# EAGLE design i2c-8ch-mux (EAGLE 7.5.0)
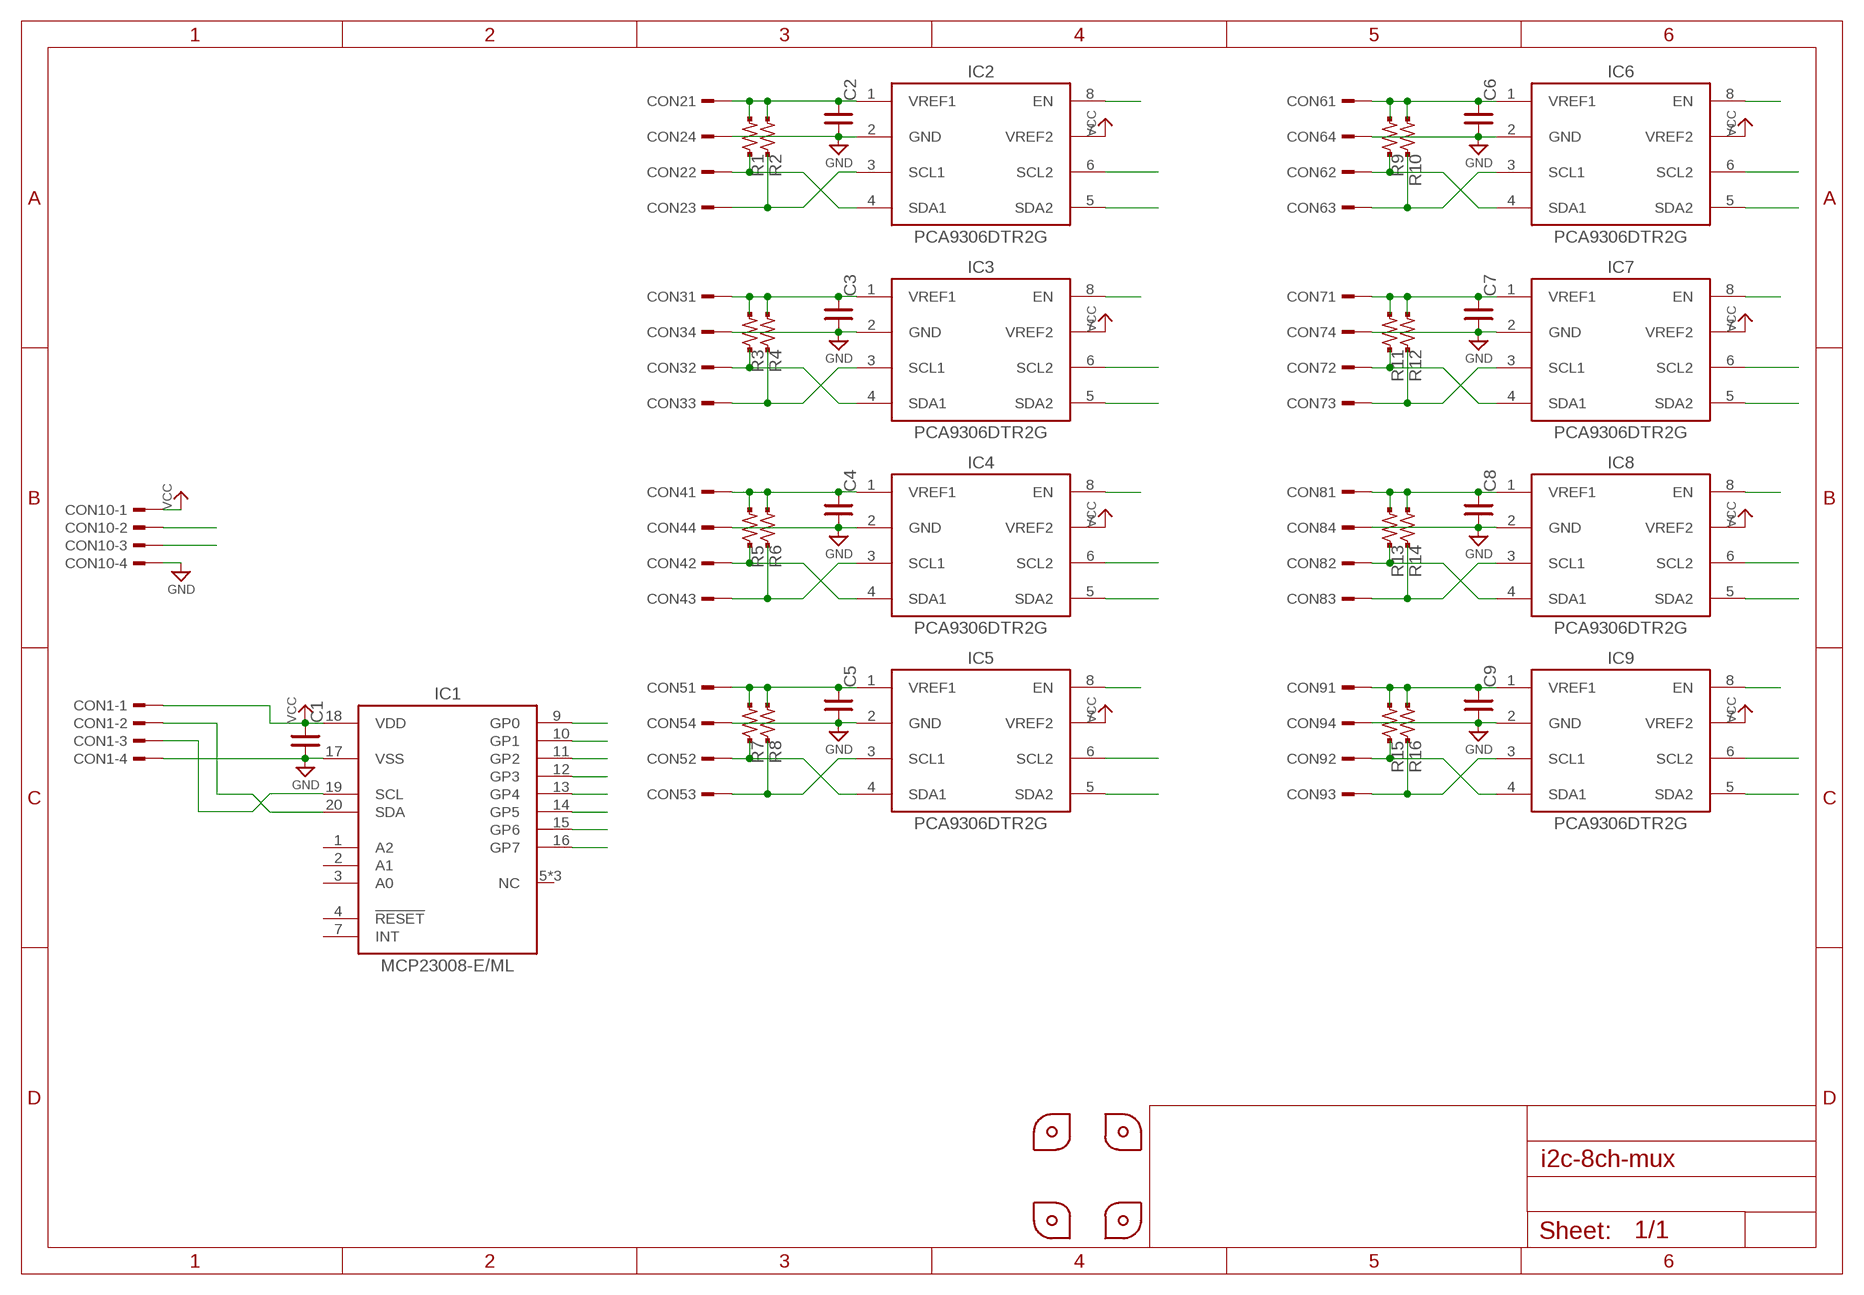
[diagram p0: schematic, sheet 1]

## Parts
C1  C-SMD-0.1U-1005  [C0402]
C2  C-SMD-0.1U-1005  [C0402]
C3  C-SMD-0.1U-1005  [C0402]
C4  C-SMD-0.1U-1005  [C0402]
C5  C-SMD-0.1U-1005  [C0402]
C6  C-SMD-0.1U-1005  [C0402]
C7  C-SMD-0.1U-1005  [C0402]
C8  C-SMD-0.1U-1005  [C0402]
C9  C-SMD-0.1U-1005  [C0402]
CON1  S4B-XH-A  [S4B-XH-A(LF)(SN)]
CON2  B4B-XH-A  [B4B-XH-A(LF)(SN)]
CON3  B4B-XH-A  [B4B-XH-A(LF)(SN)]
CON4  B4B-XH-A  [B4B-XH-A(LF)(SN)]
CON5  B4B-XH-A  [B4B-XH-A(LF)(SN)]
CON6  B4B-XH-A  [B4B-XH-A(LF)(SN)]
CON7  B4B-XH-A  [B4B-XH-A(LF)(SN)]
CON8  B4B-XH-A  [B4B-XH-A(LF)(SN)]
CON9  B4B-XH-A  [B4B-XH-A(LF)(SN)]
CON10  S4B-XH-A  [S4B-XH-A(LF)(SN)]
IC1  MCP23008-E/ML  [QFN20-0.5P4.0X4.0]
IC2  PCA9306DTR2G  [SOT65P440X300-8N]
IC3  PCA9306DTR2G  [SOT65P440X300-8N]
IC4  PCA9306DTR2G  [SOT65P440X300-8N]
IC5  PCA9306DTR2G  [SOT65P440X300-8N]
IC6  PCA9306DTR2G  [SOT65P440X300-8N]
IC7  PCA9306DTR2G  [SOT65P440X300-8N]
IC8  PCA9306DTR2G  [SOT65P440X300-8N]
IC9  PCA9306DTR2G  [SOT65P440X300-8N]
P1  PCB-CORNER  [PCB-CORNER]
P2  PCB-CORNER  [PCB-CORNER]
P3  PCB-CORNER  [PCB-CORNER]
P4  PCB-CORNER  [PCB-CORNER]
R1  R-US-10K-1005  [C0402]
R2  R-US-10K-1005  [C0402]
R3  R-US-10K-1005  [C0402]
R4  R-US-10K-1005  [C0402]
R5  R-US-10K-1005  [C0402]
R6  R-US-10K-1005  [C0402]
R7  R-US-10K-1005  [C0402]
R8  R-US-10K-1005  [C0402]
R9  R-US-10K-1005  [C0402]
R10  R-US-10K-1005  [C0402]
R11  R-US-10K-1005  [C0402]
R12  R-US-10K-1005  [C0402]
R13  R-US-10K-1005  [C0402]
R14  R-US-10K-1005  [C0402]
R15  R-US-10K-1005  [C0402]
R16  R-US-10K-1005  [C0402]

## Nets
GND: C1.2 C2.2 C3.2 C4.2 C5.2 C6.2 C7.2 C8.2 C9.2 CON1.4 CON2.4 CON3.4 CON4.4 CON5.4 CON6.4 CON7.4 CON8.4 CON9.4 CON10.4 IC1.17(VSS) IC2.2(GND) IC3.2(GND) IC4.2(GND) IC5.2(GND) IC6.2(GND) IC7.2(GND) IC8.2(GND) IC9.2(GND)
N$1: C3.1 CON3.1 IC3.1(VREF1) R3.2 R4.2
N$2: CON3.2 IC3.4(SDA1) R3.1
N$3: C5.1 CON5.1 IC5.1(VREF1) R7.2 R8.2
N$4: C2.1 CON2.1 IC2.1(VREF1) R1.2 R2.2
N$5: CON3.3 IC3.3(SCL1) R4.1
N$6: IC1.10(GP1) IC3.8(EN)
N$7: IC1.9(GP0) IC2.8(EN)
N$8: IC1.11(GP2) IC4.8(EN)
N$9: CON1.3 CON10.3 IC1.19(SCL) IC2.6(SCL2) IC3.6(SCL2) IC4.6(SCL2) IC5.6(SCL2) IC6.6(SCL2) IC7.6(SCL2) IC8.6(SCL2) IC9.6(SCL2)
N$10: CON1.2 CON10.2 IC1.20(SDA) IC2.5(SDA2) IC3.5(SDA2) IC4.5(SDA2) IC5.5(SDA2) IC6.5(SDA2) IC7.5(SDA2) IC8.5(SDA2) IC9.5(SDA2)
N$11: CON2.2 IC2.4(SDA1) R1.1
N$12: CON2.3 IC2.3(SCL1) R2.1
N$13: C8.1 CON8.1 IC8.1(VREF1) R13.2 R14.2
N$14: C9.1 CON9.1 IC9.1(VREF1) R15.2 R16.2
N$15: C4.1 CON4.1 IC4.1(VREF1) R5.2 R6.2
N$16: CON4.3 IC4.3(SCL1) R6.1
N$17: CON4.2 IC4.4(SDA1) R5.1
N$18: CON5.2 IC5.4(SDA1) R7.1
N$19: CON5.3 IC5.3(SCL1) R8.1
N$20: C6.1 CON6.1 IC6.1(VREF1) R9.2 R10.2
N$21: CON7.2 IC7.4(SDA1) R11.1
N$22: CON7.3 IC7.3(SCL1) R12.1
N$23: IC1.12(GP3) IC5.8(EN)
N$24: IC1.13(GP4) IC6.8(EN)
N$25: IC1.14(GP5) IC7.8(EN)
N$26: IC1.15(GP6) IC8.8(EN)
N$27: IC1.16(GP7) IC9.8(EN)
N$28: C7.1 CON7.1 IC7.1(VREF1) R11.2 R12.2
N$29: CON6.2 IC6.4(SDA1) R9.1
N$30: CON6.3 IC6.3(SCL1) R10.1
N$31: CON8.2 IC8.4(SDA1) R13.1
N$32: CON8.3 IC8.3(SCL1) R14.1
N$33: CON9.2 IC9.4(SDA1) R15.1
N$34: CON9.3 IC9.3(SCL1) R16.1
VCC: C1.1 CON1.1 CON10.1 IC1.18(VDD) IC2.7(VREF2) IC3.7(VREF2) IC4.7(VREF2) IC5.7(VREF2) IC6.7(VREF2) IC7.7(VREF2) IC8.7(VREF2) IC9.7(VREF2)
Unconnected: IC1.1(A2) IC1.2(A1) IC1.3(A0) IC1.4(!RESET!) IC1.5(NC) IC1.6(NC) IC1.7(INT) IC1.8(NC)

## Library data of the parts
C1-C9 = mylib:C-SMD-*: SMD CAPACITOR; DIGIKEY: 490-3261-1-ND; SEEED: 302010024; SMD-PAD: 2
CON1 CON10 = mylib:S4B-XH-A
CON2-CON9 = mylib:B4B-XH-A
IC1 = mylib:MCP23008
IC2-IC9 = mylib:PCA9306
P1-P4 = mylib:PCB-CORNER; NOT-COMPONENT: YES
R1-R16 = mylib:R-US-*: SMD resistor Packages : -1608 : 1.6 x 0.8 mm -2125 : 2.0 x 1.25 mm -3216 : 3.2 x 1.6 mm; DIGIKEY: P10.0KLCT-ND; SEEED: 301010047; SMD-PAD: 2

## Board
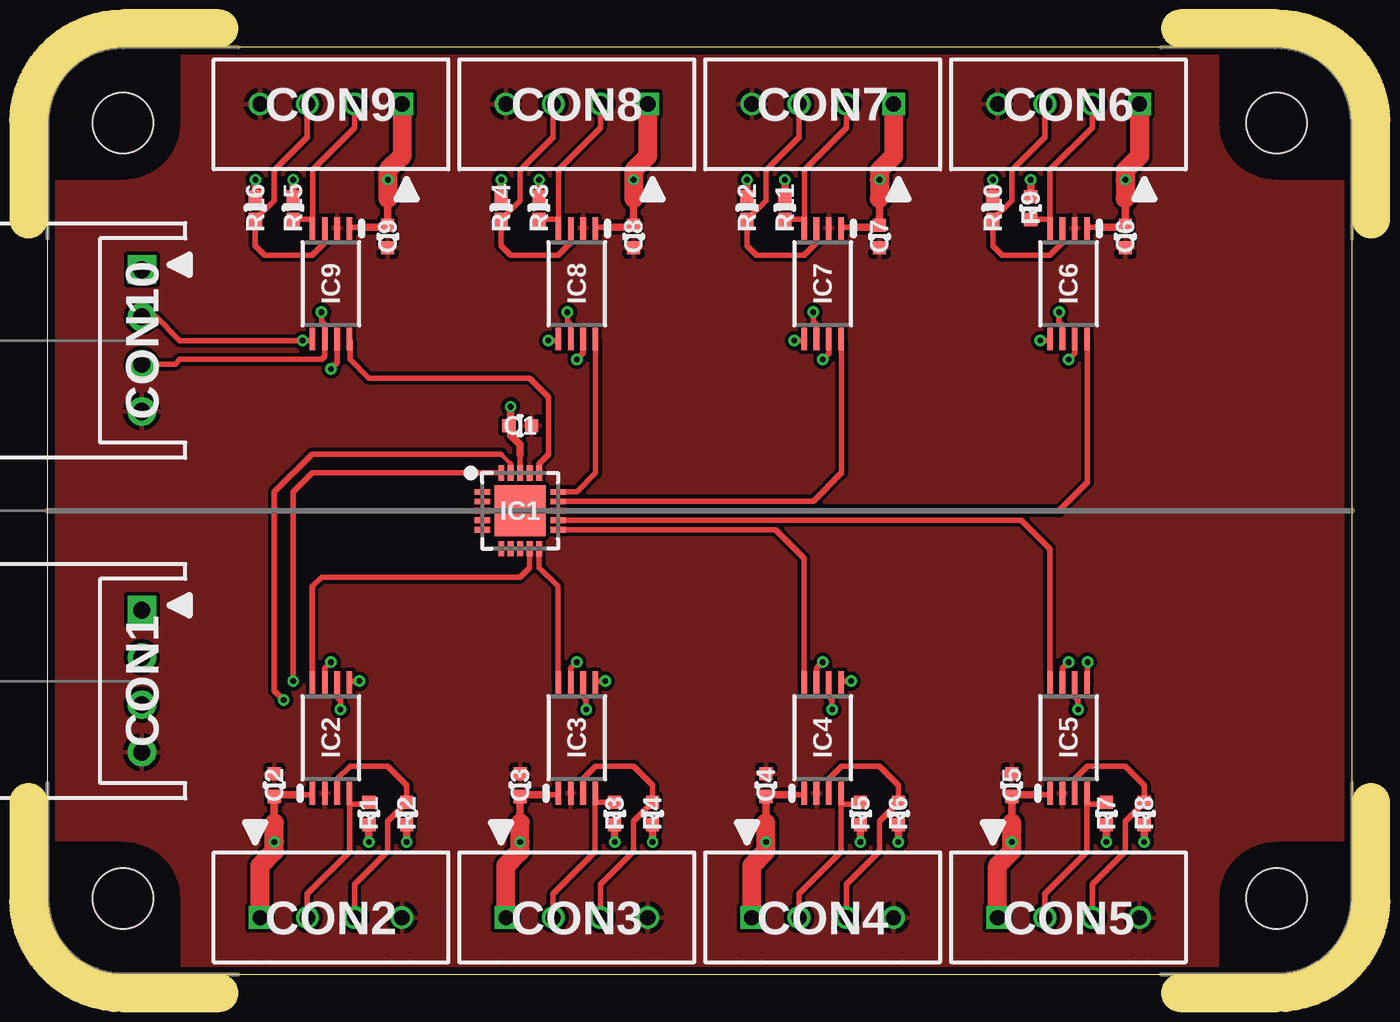
[diagram p1: board, top side]
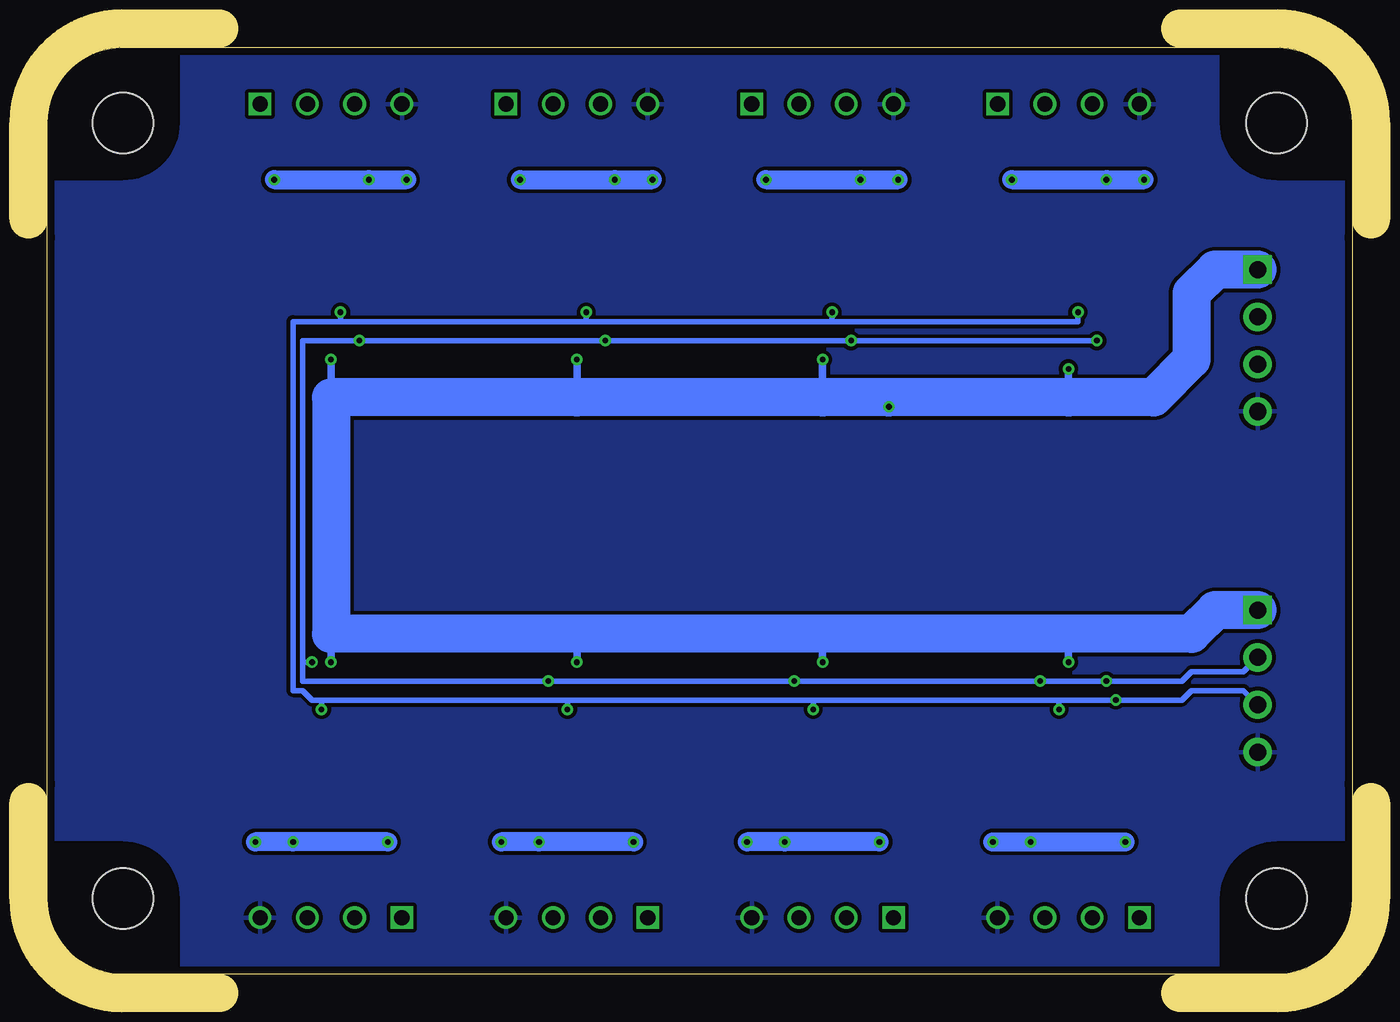
[diagram p2: board, bottom side, seen from below]

Size 69 x 49 mm. Coordinates in mm from the lower left corner, seen from the top.
Outline: 0,39 0,10
Outline: 10,0 59,0
Outline: 69,10 69,39
Outline: 59,49 10,49
Copper layers (1*16): Top 0.035mm / dielectric 1.5mm / Bottom 0.035mm
Design rules "default *": minimum track width 0.2mm, minimum drill 0.3mm, track to track 0.2mm, track to pad 0.2mm, pad to pad 0.2mm, via to via 0.2mm, smd to smd 0mil, copper to edge 0.4mm, drill to drill 8mil, minimum pad ring 0.15mm, minimum via ring 0.15mm, stop-mask expansion 4mil, vias tented up to drill 100mil, thermal gap 10mil

### Footprints (pad centres in the part's own frame; a part is rotated, then mirrored left to right if it is on the bottom)
C0402 = smd 0.7 x 0.7: 1 -0.6,0; 2 0.6,0
S4B-XH-A(LF)(SN) = drill 0.9 pad 1.5 square: 1 -3.75,0 | drill 0.9 pad 1.5: 2 -1.25,0; 3 1.25,0; 4 3.75,0
B4B-XH-A(LF)(SN) = drill 0.8 square: 1 3.75,0 | drill 0.8: 2 1.25,0; 3 -1.25,0; 4 -3.75,0
QFN20-0.5P4.0X4.0 = smd 0.8 x 0.3: 1 -2,1; 2 -2,0.5; 3 -2,0; 4 -2,-0.5; 5 -2,-1; 11 2,-1; 12 2,-0.5; 13 2,0; 14 2,0.5; 15 2,1 | smd 0.3 x 0.8: 6 -1,-2; 7 -0.5,-2; 8 0,-2; 9 0.5,-2; 10 1,-2; 16 1,2; 17 0.5,2; 18 0,2; 19 -0.5,2; 20 -1,2 | smd 2.7 x 2.7: EP 0,0
SOT65P440X300-8N = smd 0.3 x 1.2: 1 -0.975,-2.925; 2 -0.325,-2.925; 3 0.325,-2.925; 4 0.975,-2.925; 5 0.975,2.925; 6 0.325,2.925; 7 -0.325,2.925; 8 -0.975,2.925
PCB-CORNER = hole 3.2: 0,0

### Placement (x,y rotation side)
C1  25,29 0 top
C2  12,10 90 top
C3  25,10 90 top
C4  38,10 90 top
C5  51,10 90 top
C6  57,39 270 top
C7  44,39 270 top
C8  31,39 270 top
C9  18,39 270 top
CON1  5,15.5 270 top
CON2  15,3 180 top
CON3  28,3 180 top
CON4  41,3 180 top
CON5  54,3 180 top
CON6  54,46 0 top
CON7  41,46 0 top
CON8  28,46 0 top
CON9  15,46 0 top
CON10  5,33.5 270 top
IC1  25,24.5 0 top
IC2  15,12.5 0 top
IC3  28,12.5 0 top
IC4  41,12.5 0 top
IC5  54,12.5 0 top
IC6  54,36.5 180 top
IC7  41,36.5 180 top
IC8  28,36.5 180 top
IC9  15,36.5 180 top
P1  4,4 270 top
P2  65,4 0 top
P3  4,45 180 top
P4  65,45 90 top
R1  17,8.5 270 top
R2  19,8.5 270 top
R3  30,8.5 270 top
R4  32,8.5 270 top
R5  43,8.5 270 top
R6  45,8.5 270 top
R7  56,8.5 270 top
R8  58,8.5 270 top
R9  52,40.5 90 top
R10  50,40.5 90 top
R11  39,40.5 90 top
R12  37,40.5 90 top
R13  26,40.5 90 top
R14  24,40.5 90 top
R15  13,40.5 90 top
R16  11,40.5 90 top

### Tracks (layer width: path | path; a pad name or v marks a point on that pad's centre or on a via)
GND
  pour Bottom (rank 2): 0,49 69,49 69,0 0,0
  pour Top: 0,49 69,49 69,0 0,0
N$1  (via drill 0.3)
  Top 0.3: IC3.1 27.02,9.53 27,9.5 26.5,9.5
  Top 0.4: 26.5,9.5 25,9.5 C3.1 25,8 | R4.2 v32,7 | R3.2 v30,7
  Top 1: CON3.1 24.25,5.75 25,6.5 v25,7 25,8
  Bottom 1: v25,7 v30,7 v32,7
N$2
  Top 0.3: R3.1 28.98,9.1 | 28.98,9.1 IC3.4 | CON3.2 26.75,4.25 28.98,6.47 28.98,9.1
N$3  (via drill 0.3)
  Top 0.3: IC5.1 53.02,9.53 53,9.5 52.5,9.5
  Top 0.4: 52.5,9.5 51,9.5 C5.1 51,8 | R8.2 v58,7 | R7.2 v56,7
  Top 1: CON5.1 50.25,5.75 51,6.5 v51,7 51,8
  Bottom 1: v51,7 v56,7 v58,7
N$4  (via drill 0.3)
  Top 0.3: IC2.1 14.03,9.53 14,9.5 13.5,9.5
  Top 0.4: 13.5,9.5 12,9.5 C2.1 12,8 | R2.2 v19,7 | R1.2 v17,7
  Top 1: CON2.1 11.25,5.75 12,6.5 v12,7 12,8
  Bottom 1: v19,7 v17,7 v12,7
N$5
  Top 0.3: IC3.3 28.32,10.32 29,11 31,11 32,10 R4.1 31,8.1 31,6.5 29.25,4.75 CON3.3
N$6
  Top 0.3: IC1.10 26,21.5 27,20.5 27,15.5 27.02,15.47 IC3.8
N$7
  Top 0.3: IC1.9 25.5,21.5 25,21 14.5,21 14,20.5 14,15.5 14.03,15.47 IC2.8
N$8
  Top 0.3: IC4.8 40.02,15.47 40,15.5 40,22 38.5,23.5 IC1.11
N$9  (via drill 0.3)
  Top 0.2: 24.5,27 24,27.5
  Top 0.3: IC2.6 15.32,14.68 15.5,14.5 v15.5,14 | IC3.6 28.32,14.68 28.5,14.5 v28.5,14 | IC4.6 41.33,14.68 41.5,14.5 v41.5,14 | IC5.6 54.33,14.68 54.5,14.5 v54.5,14 | v14.5,35 14.5,34.5 14.68,34.33 IC9.6 14.68,32.67 14.5,32.5 7,32.5 6.75,32.25 CON10.3 | IC8.6 27.68,34.33 27.5,34.5 v27.5,35 | IC7.6 40.67,34.33 40.5,34.5 v40.5,35 | IC6.6 53.67,34.33 53.5,34.5 v53.5,35 | v12.5,14.5 12,15 12,25.5 14,27.5 24,27.5 | IC1.19 24.5,27
  Bottom 0.3: 54.5,14.5 55,14.5 55.5,15 56,15 56,34.5 53.5,34.5 | 54.5,14.5 41.5,14.5 | 41.5,14.5 28.5,14.5 | 28.5,14.5 15.5,14.5 | 15.5,14.5 v12.5,14.5 9,14.5 8.5,15 5.75,15 CON1.3 | v41.5,14 41.5,14.5 | v54.5,14 54.5,14.5 | 53.5,34.5 40.5,34.5 | 40.5,34.5 27.5,34.5 | 27.5,34.5 14.5,34.5 v14.5,35 | v53.5,35 53.5,34.5 | v40.5,35 40.5,34.5 | v27.5,35 27.5,34.5 | v28.5,14 28.5,14.5 | v15.5,14 15.5,14.5
N$10  (via drill 0.3)
  Top 0.3: IC9.5 14.03,33.52 14,33.5 v13.5,33.5 7,33.5 5.75,34.75 CON10.2 | IC8.5 26.95,33.5 v26.5,33.5 | IC7.5 39.95,33.5 v39.5,33.5 | IC6.5 52.95,33.5 v52.5,33.5 | IC4.5 42.05,15.5 v42.5,15.5 | IC3.5 29.05,15.5 v29.5,15.5 | IC2.5 16.05,15.5 v16.5,15.5 | v13,15.5 13,25.5 14,26.5 IC1.20 | IC5.5 54.98,15.47 55,15.5 v55,16.5
  Bottom 0.3: 55.5,16.5 55.5,15.5 v42.5,15.5 v29.5,15.5 v16.5,15.5 v13,15.5 9,15.5 8.5,16 5.75,16 CON1.2 | 55.5,16.5 55.5,33.5 v52.5,33.5 v39.5,33.5 v26.5,33.5 v13.5,33.5 | v55,16.5 55.5,16.5
N$11
  Top 0.3: R1.1 17,9 15.97,9 | 15.97,9 IC2.4 | 15.97,9 15.97,6.47 13.75,4.25 CON2.2
N$12
  Top 0.3: IC2.3 15.32,10.32 16,11 18,11 19,10 R2.1 18,8.1 18,6.5 16.25,4.75 CON2.3
N$13  (via drill 0.3)
  Top 0.3: IC8.1 28.98,39.48 29,39.5 29.5,39.5
  Top 0.4: 31,41 C8.1 31,39.5 29.5,39.5 | R13.2 v26,42 | v24,42 R14.2
  Top 1: CON8.1 31.75,43.25 31,42.5 v31,42 31,41
  Bottom 1: v31,42 v26,42 v24,42
N$14  (via drill 0.3)
  Top 0.3: IC9.1 15.97,39.48 16,39.5 16.5,39.5 | C9.1 18,39.5
  Top 0.4: 18,39.5 16.5,39.5 | C9.1 18,41 | R15.2 v13,42 | R16.2 v11,42
  Top 1: CON9.1 18.75,43.25 18,42.5 v18,42 18,41
  Bottom 1: v18,42 v13,42 v11,42
N$15  (via drill 0.3)
  Top 0.3: IC4.1 40.02,9.53 40,9.5 39.5,9.5
  Top 0.4: 39.5,9.5 38,9.5 C4.1 38,8 | R6.2 v45,7 | R5.2 v43,7
  Top 1: CON4.1 37.25,5.75 38,6.5 v38,7 38,8
  Bottom 1: v38,7 v43,7 v45,7
N$16
  Top 0.3: CON4.3 42.25,4.75 44,6.5 44,8.1 R6.1 45,10 44,11 42,11 41.33,10.32 IC4.3
N$17
  Top 0.3: R5.1 43,9 41.98,9 | 41.98,9 IC4.4 | CON4.2 39.75,4.25 41.98,6.47 41.98,9
N$18
  Top 0.3: R7.1 56,9 54.98,9 | 54.98,9 IC5.4 | 54.98,9 54.98,6.47 52.75,4.25 CON5.2
N$19
  Top 0.3: IC5.3 54.33,10.32 55,11 57,11 58,10 R8.1 57,8.1 57,6.5 55.25,4.75 CON5.3
N$20  (via drill 0.3)
  Top 0.3: IC6.1 54.98,39.48 55,39.5 55.5,39.5
  Top 0.4: 57,41 C6.1 57,39.5 55.5,39.5 | R9.2 v52,42 | v50,42 R10.2
  Top 1: CON6.1 57.75,43.25 57,42.5 v57,42 57,41
  Bottom 1: v57,42 v52,42 v50,42
N$21
  Top 0.3: IC7.4 40.02,39.9 | 40.02,39.9 R11.1 | CON7.2 42.25,44.75 40.02,42.52 40.02,39.9
N$22
  Top 0.3: CON7.3 39.75,44.25 38,42.5 38,40.9 R12.1 37,38.5 37.5,38 40,38 40.67,38.67 IC7.3
N$23
  Top 0.3: IC5.8 53.02,15.47 53,15.5 53,22.5 51.5,24 IC1.12
N$24
  Top 0.3: IC6.8 54.98,33.52 55,33.5 55,26 53.5,24.5 IC1.13
N$25
  Top 0.3: IC7.8 41.98,33.52 42,33.5 42,26.5 40.5,25 IC1.14
N$26
  Top 0.3: IC8.8 28.98,33.52 29,33.5 29,26.5 28,25.5 IC1.15
N$27
  Top 0.3: IC1.16 26,27 26.5,27.5 26.5,30.5 25.5,31.5 17,31.5 16,32.5 16,33.5 15.97,33.52 IC9.8
N$28  (via drill 0.3)
  Top 0.3: IC7.1 41.98,39.48 42,39.5 42.5,39.5
  Top 0.4: 44,41 C7.1 44,39.5 42.5,39.5 | R11.2 v39,42 | v37,42 R12.2
  Top 1: CON7.1 44.75,43.25 44,42.5 v44,42 44,41
  Bottom 1: v44,42 v39,42 v37,42
N$29
  Top 0.3: R9.1 53.02,39.9 IC6.4 53.02,42.52 55.25,44.75 CON6.2
N$30
  Top 0.3: CON6.3 52.75,44.25 51,42.5 51,40.9 R10.1 50,38.5 50.5,38 53,38 53.67,38.67 IC6.3
N$31
  Top 0.3: CON8.2 29.25,44.75 27.02,42.52 27.02,39.9 | IC8.4 27.02,39.9 | 27.02,39.9 R13.1
N$32
  Top 0.3: CON8.3 26.75,44.25 25,42.5 25,40.9 R14.1 24,38.5 24.5,38 27,38 27.68,38.67 IC8.3
N$33
  Top 0.3: CON9.2 16.25,44.75 14.03,42.52 14.03,39.9 | IC9.4 14.03,39.9 | 14.03,39.9 R15.1
N$34
  Top 0.3: CON9.3 13.75,44.25 12,42.5 12,40.9 R16.1 11,38.5 11.5,38 14,38 14.68,38.67 IC9.3
VCC  (via drill 0.3)
  Top 0.3: IC6.7 54.33,32.83 v54,32.5 | IC7.7 41.33,32.83 v41,32.5 | IC8.7 28.32,32.83 v28,32.5 | IC9.7 15.32,32.33 v15,32 | IC2.7 14.68,16.18 v15,16.5 | IC3.7 27.68,16.18 v28,16.5 | IC4.7 40.67,16.18 v41,16.5 | IC5.7 53.67,16.18 v54,16.5 | IC1.18 25,27.5
  Top 0.4: C1.1 24.5,29 | 24.5,29 v24.5,30 | 25,27.5 25,28 24.5,28.5 24.5,29
  Bottom 0.4: v54,32.5 54,30.5 | 41,30.5 v41,32.5 | v28,32.5 28,30.5 | v24.5,30 24.5,30.5 | 15,18 v15,16.5 | v28,16.5 28,18 | v41,16.5 41,18 | v54,16.5 54,18 | v15,32 15,30.5
  Bottom 2: CON1.1 7.25,19.25 8.5,18 15,18 28,18 41,18 54,18 54,30.5 41,30.5 28,30.5 24.5,30.5 15,30.5 10.5,30.5 8.5,32.5 8.5,36 7.25,37.25 CON10.1